# Altium schematic sheet AFE_Power.SchDoc
size A4; SheetNumber: 3; SheetTotal: 3
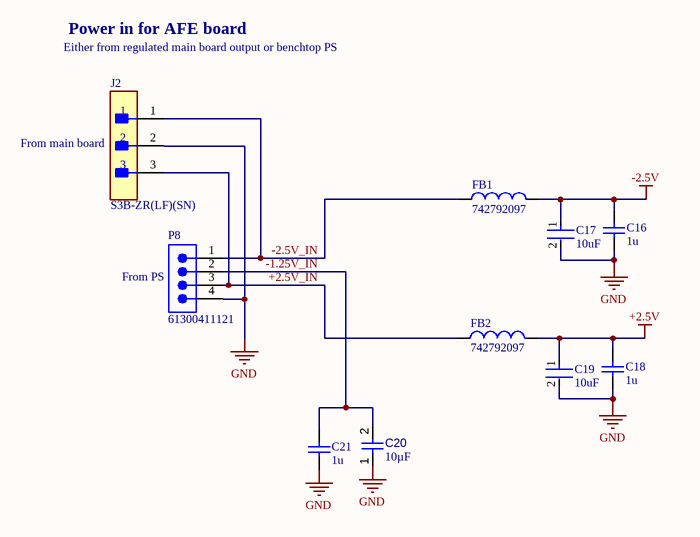
[diagram p0: AFE_Power.SchDoc]

## Parts
C16  1u  [WCAP-CSGP_0402_L1W0.5H0.5]
C17  10uF  [FP-GRM188-0_1-e0_2_0_55-IPC_A]
C18  1u  [WCAP-CSGP_0402_L1W0.5H0.5]
C19  10uF  [FP-GRM188-0_1-e0_2_0_55-IPC_A]
C20  value 10µF  [CAPC0603(1608)100_L]  (hidden comment: Capacitor 10µF +/-20% 10V 0603)
C21  1u  [WCAP-CSGP_0402_L1W0.5H0.5]
FB1  742792097  [WE-CBF_0805_L2W1.2H0.9_HC]
FB2  742792097  [WE-CBF_0805_L2W1.2H0.9_HC]
J2  S3B-ZR(LF)(SN)  [FP-S3B-ZR_LF_SN-MFG]
P8  61300411121  [61300411121]

## Nets
+2.5V: C18.2 C19.1 FB2.2
-2.5V: C16.2 C17.1 FB1.2
GND: C16.1 C17.2 C18.1 C19.2 C20.1 C21.1 J2.2 P8.4
+2.5V_IN: FB2.1 J2.3 P8.3
-1.25V_IN: C20.2 C21.2 P8.2
-2.5V_IN: FB1.1 J2.1 P8.1

## Notes on the sheet
- Power in for AFE board
- Either from regulated main board output or benchtop PS
- (near J2) From main board
- (near P8) From PS

## Library data of the parts
C16 C18 C21 = CMP-207839-000017-2: CAP CER 10000PF 50V X7R 0402; NexarPartId: 53703204; Insulation Resistance: 10GΩ; Material: Ceramic; Tolerance: 10%; Capacitance: 10nF; Packaging: Tape & Reel (TR); Voltage Rating: 50V; Thickness: 558.8µm; Case Code (Imperial): 0402; Dielectric: X7R; Mount: Surface Mount; Width: 500µm; Height: 500µm; Min Operating Temperature: -55°C; Case/Package: 0402; RoHS: Compliant; Case Code (Metric): 1005; REACH SVHC: Unknown; Max Operating Temperature: 125°C; Voltage Rating (DC): 50V; Length: 1mm
C17 C19 = CMP-2006-02792-2: Chip Multilayer Ceramic Capacitors for General Purpose, 0603, 10uF, X5R, 15%, 20%, 6.3V; Packaging: Tape and Reel; Voltage Rating (DC): 6.3V; Width: 0.031inch; Termination: SMD/SMT; Dielectric: X5R; Package Quantity: 4000; Voltage Rating: 6.3V; Capacitance: 10uF; Case/Package: 0603; Min Operating Temperature: -55°C; Voltage: 6.3V; Length: 1.6mm; Thickness: 0.035inch; Lead Free: Lead Free; Depth: 0.8mm; Case Code (Imperial): 0603; Max Operating Temperature: 85°C; Material: Ceramic; Height: 0.8mm; Tolerance: 20%; Mount: Surface Mount; REACH SVHC: No SVHC; Radiation Hardening: No; Case Code (Metric): 1608
C20 = CMP-001-00075-4: Chip Capacitor, 10µF +/-20%, 10V, 0603, Thickness 1 mm; Tolerance: 10%; Voltage Rating: 10V; Max Operating Temperature: 85°C; Pins: 2; Case/Package: 0603; Mounting Technology: SMT; Min Operating Temperature: -55°C
FB1 FB2 = CMP-0220-00149-3: NexarPartId: 22803129; Max Current Rating: 1A; Inductance: 1.8nH; Resistance: 300mΩ; Number of Lines: 1; Test Frequency: 100MHz; Tolerance: 25%; Impedance: 1.5kΩ; Min Operating Temperature: -55°C; Core Material: Ferrite; Depth: 1.2mm; Lead Free: Lead Free; Length: 2mm; Packaging: Digi-Reel®; Case Code (Imperial): 0805; Current Rating: 1A; Max Operating Temperature: 125°C; Case Code (Metric): 2012; RoHS: Compliant; RMS Current (Irms): 1A; Mount: Surface Mount; Material: Ferrite; DC Resistance (DCR): 300mΩ; Height: 900µm; Series Resistance: 300mΩ; Termination: SMD/SMT; Max DC Current: 1A; Weight: 10.999615mg; REACH SVHC: Unknown; Width: 1.2mm; Case/Package: 0805
J2 = CMP-17439-000198-1: CONN HEADER R/A 3POS 1.5MM; Voltage Rating: 50V; Max Current Rating: 1A; Number of Contacts: 3; Panel Thickness: 3.5mm; Gender: Male; Body Plating: Tin; Contact Resistance: 30mR; Insulation Resistance: 500MR; Housing Color: Beige; Width: 3.5mm; Min Operating Temperature: -25°C; Contact Mating Length: 0.094inch; Material: Nylon; Fastening Type: Detent; Housing Material: Polyamide; Termination: Solder; Number of Pins: 3; Max Operating Temperature: 85°C; Voltage Rating (DC): 50V; Contact Shape: Circular; Depth: 6mm; Lead Free: Lead Free; Number of Rows: 1; Orientation: Right Angle; Flammability Rating: UL94 V-0; Height: 7.2mm; Pitch: 1.5mm; Connector Type: Header; Contact Material: Brass; REACH SVHC: No SVHC; Current Rating: 1A; Packaging: Bulk; Contact Type: Male Pin; Number of Positions: 3; Mount: Through Hole; Contact Plating: Tin; Voltage Rating (AC): 50V; Max Voltage Rating (AC): 50V; Lead Pitch: 1.5mm; Series: ZH; Insulation Material: Nylon; Length: 6mm; Contact Finish - Mating: TIN; Insulation Color: Natural; Color: White
P8 = CMP-1502-01064-3: NexarPartId: 32855522; Operating Supply Voltage: 250V; Pitch: 2.54mm; Contact Resistance: 20mΩ; Number of Positions: 4; Current Rating: 3A; Connector Type: Male Pin; Gender: Male; Contact Plating: Gold; Height: 8.89mm; Lead Pitch: 2.54mm; Lead Free: Lead Free; Contact Mating Length: 5.9944mm; Number of Rows: 1; Termination: Solder; Packaging: Bulk; REACH SVHC: Unknown; Min Operating Temperature: -40°C; RoHS: Compliant; Number of Contacts: 4; Voltage Rating: 250V; Color: Black; Max Operating Temperature: 105°C; Contact Material: Copper; Mount: Through Hole; Orientation: Vertical; Number of Pins: 4